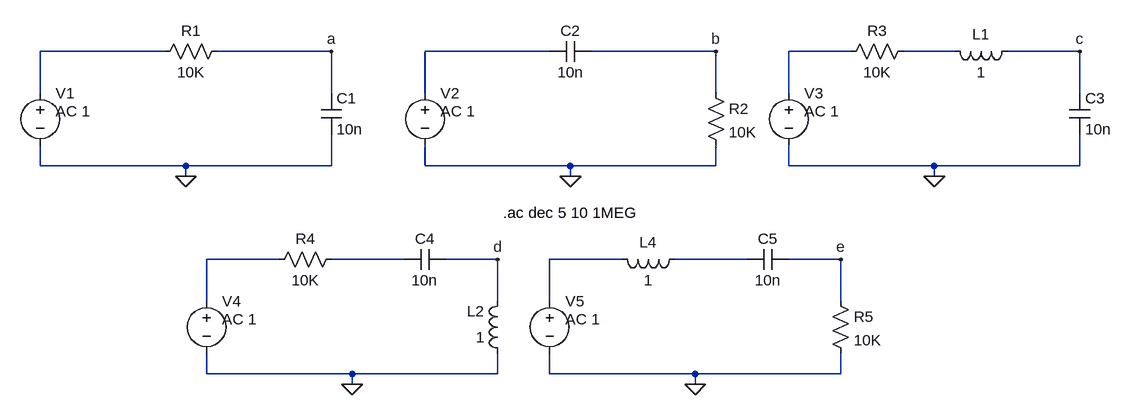
[diagram p0: schematic Filtros.asc]
Filtros.asc, the LTspice schematic file:
Version 4
SHEET 1 2760 680
WIRE 176 -848 -16 -848
WIRE 432 -848 256 -848
WIRE 768 -848 576 -848
WIRE 1024 -848 832 -848
WIRE 1232 -848 1136 -848
WIRE 1392 -848 1312 -848
WIRE 1584 -848 1472 -848
WIRE -16 -784 -16 -848
WIRE 432 -784 432 -848
WIRE 576 -784 576 -848
WIRE 1024 -784 1024 -848
WIRE 1136 -784 1136 -848
WIRE 1584 -784 1584 -848
WIRE -16 -672 -16 -704
WIRE 208 -672 -16 -672
WIRE 432 -672 432 -720
WIRE 432 -672 208 -672
WIRE 576 -672 576 -704
WIRE 800 -672 576 -672
WIRE 1024 -672 1024 -704
WIRE 1024 -672 800 -672
WIRE 1136 -672 1136 -704
WIRE 1360 -672 1136 -672
WIRE 1584 -672 1584 -720
WIRE 1584 -672 1360 -672
WIRE 208 -656 208 -672
WIRE 800 -656 800 -672
WIRE 1360 -656 1360 -672
WIRE 352 -528 240 -528
WIRE 544 -528 432 -528
WIRE 688 -528 608 -528
WIRE 880 -528 768 -528
WIRE 1072 -528 960 -528
WIRE 1216 -528 1136 -528
WIRE 240 -464 240 -528
WIRE 688 -464 688 -528
WIRE 768 -464 768 -528
WIRE 1216 -464 1216 -528
WIRE 240 -352 240 -384
WIRE 464 -352 240 -352
WIRE 688 -352 688 -384
WIRE 688 -352 464 -352
WIRE 768 -352 768 -384
WIRE 992 -352 768 -352
WIRE 1216 -352 1216 -384
WIRE 1216 -352 992 -352
WIRE 464 -336 464 -352
WIRE 992 -336 992 -352
FLAG 208 -656 0
FLAG 432 -848 a
FLAG 800 -656 0
FLAG 1024 -848 b
FLAG 1360 -656 0
FLAG 1584 -848 c
FLAG 464 -336 0
FLAG 688 -528 d
FLAG 992 -336 0
FLAG 1216 -528 e
SYMBOL res 160 -832 R270
WINDOW 0 32 56 VTop 2
WINDOW 3 0 56 VBottom 2
SYMATTR InstName R1
SYMATTR Value 10K
SYMBOL cap 416 -784 R0
SYMATTR InstName C1
SYMATTR Value 10n
SYMBOL voltage -16 -800 R0
WINDOW 123 24 44 Left 2
WINDOW 39 0 0 Left 0
SYMATTR Value2 AC 1
SYMATTR InstName V1
SYMATTR Value ""
SYMBOL res 1008 -800 R0
SYMATTR InstName R2
SYMATTR Value 10K
SYMBOL cap 832 -864 R90
WINDOW 0 0 32 VBottom 2
WINDOW 3 32 32 VTop 2
SYMATTR InstName C2
SYMATTR Value 10n
SYMBOL voltage 576 -800 R0
WINDOW 123 24 44 Left 2
WINDOW 39 0 0 Left 0
SYMATTR Value2 AC 1
SYMATTR InstName V2
SYMATTR Value ""
SYMBOL res 1216 -832 R270
WINDOW 0 32 56 VTop 2
WINDOW 3 0 56 VBottom 2
SYMATTR InstName R3
SYMATTR Value 10K
SYMBOL cap 1568 -784 R0
SYMATTR InstName C3
SYMATTR Value 10n
SYMBOL voltage 1136 -800 R0
WINDOW 123 24 44 Left 2
WINDOW 39 0 0 Left 0
SYMATTR Value2 AC 1
SYMATTR InstName V3
SYMATTR Value ""
SYMBOL ind 1488 -864 R90
WINDOW 0 5 56 VBottom 2
WINDOW 3 32 56 VTop 2
SYMATTR InstName L1
SYMATTR Value 1
SYMBOL res 448 -544 R90
WINDOW 0 0 56 VBottom 2
WINDOW 3 32 56 VTop 2
SYMATTR InstName R4
SYMATTR Value 10K
SYMBOL cap 608 -544 R90
WINDOW 0 0 32 VBottom 2
WINDOW 3 32 32 VTop 2
SYMATTR InstName C4
SYMATTR Value 10n
SYMBOL voltage 240 -480 R0
WINDOW 123 24 44 Left 2
WINDOW 39 0 0 Left 0
SYMATTR Value2 AC 1
SYMATTR InstName V4
SYMATTR Value ""
SYMBOL ind 704 -368 R180
WINDOW 0 36 80 Left 2
WINDOW 3 36 40 Left 2
SYMATTR InstName L2
SYMATTR Value 1
SYMBOL cap 1136 -544 R90
WINDOW 0 0 32 VBottom 2
WINDOW 3 32 32 VTop 2
SYMATTR InstName C5
SYMATTR Value 10n
SYMBOL voltage 768 -480 R0
WINDOW 123 24 44 Left 2
WINDOW 39 0 0 Left 0
SYMATTR Value2 AC 1
SYMATTR InstName V5
SYMATTR Value ""
SYMBOL ind 976 -544 R90
WINDOW 0 5 56 VBottom 2
WINDOW 3 32 56 VTop 2
SYMATTR InstName L4
SYMATTR Value 1
SYMBOL res 1200 -480 R0
SYMATTR InstName R5
SYMATTR Value 10K
TEXT 696 -600 Left 2 !.ac dec 5 10 1MEG

The netlist it stands for:
* Filtros.asc
R1 N001 a 10K
C1 a 0 10n
V1 N001 0 AC 1
R2 b 0 10K
C2 b N002 10n
V2 N002 0 AC 1
R3 N003 N004 10K
C3 c 0 10n
V3 N003 0 AC 1
L1 c N004 1
R4 N006 N005 10K
C4 d N006 10n
V4 N005 0 AC 1
L2 0 d 1
C5 e N008 10n
V5 N007 0 AC 1
L4 N008 N007 1
R5 e 0 10K
.ac dec 5 10 1MEG
.backanno
.end